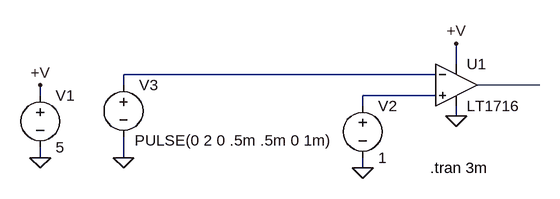
[diagram p0: schematic 1716.asc]
1716.asc, the LTspice schematic file:
Version 4
SHEET 1 880 800
WIRE 208 256 208 224
WIRE 176 272 -304 272
WIRE -304 288 -304 272
WIRE 336 288 240 288
WIRE -432 304 -432 288
WIRE 176 304 64 304
WIRE 64 320 64 304
WIRE 208 336 208 320
WIRE -432 400 -432 384
WIRE -304 400 -304 368
WIRE 64 416 64 400
FLAG -432 400 0
FLAG -432 288 +V
FLAG 208 224 +V
FLAG -304 400 0
FLAG 64 416 0
FLAG 208 336 0
SYMBOL voltage -432 288 R0
SYMATTR InstName V1
SYMATTR Value 5
SYMBOL voltage -304 272 R0
WINDOW 3 17 101 Left 0
WINDOW 123 0 0 Left 0
WINDOW 39 0 0 Left 0
SYMATTR Value PULSE(0 2 0 .5m .5m 0 1m)
SYMATTR InstName V3
SYMBOL voltage 64 304 R0
SYMATTR InstName V2
SYMATTR Value 1
SYMBOL Comparators\\LT1716 208 288 R0
SYMATTR InstName U1
TEXT 168 416 Left 0 !.tran 3m

The netlist it stands for:
* 1716.asc
V1 +V 0 5
V3 N001 0 PULSE(0 2 0 .5m .5m 0 1m)
V2 N003 0 1
XU1 N003 N001 +V 0 N002 LT1716  ; pins In+ In- V+ V- OUT
.tran 3m
.lib LTC1.lib
.backanno
.end